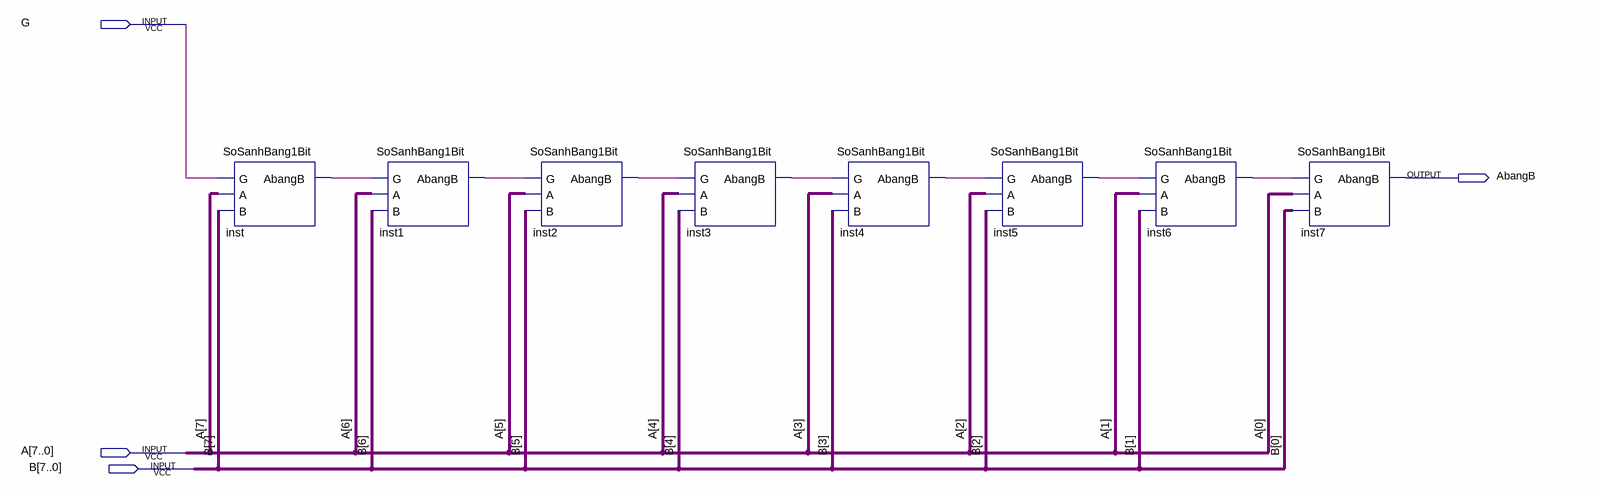
[diagram p0: schematic sheet]
// Quartus schematic SoSanh8bit.bdf as structural Verilog: 8 symbols, 4 pins
module SoSanh8bit (
  input  G,
  input  [7:0] A,
  input  [7:0] B,
  output AbangB
);

  wire inst1_abangb, inst2_abangb, inst3_abangb, inst4_abangb, inst5_abangb, inst6_abangb, inst_abangb;

  SoSanhBang1Bit inst (.G(G), .A(A[7]), .B(B[7]), .AbangB(inst_abangb));
  SoSanhBang1Bit inst1 (.G(inst_abangb), .A(A[6]), .B(B[6]), .AbangB(inst1_abangb));
  SoSanhBang1Bit inst2 (.G(inst1_abangb), .A(A[5]), .B(B[5]), .AbangB(inst2_abangb));
  SoSanhBang1Bit inst3 (.G(inst2_abangb), .A(A[4]), .B(B[4]), .AbangB(inst3_abangb));
  SoSanhBang1Bit inst4 (.G(inst3_abangb), .A(A[3]), .B(B[3]), .AbangB(inst4_abangb));
  SoSanhBang1Bit inst5 (.G(inst4_abangb), .A(A[2]), .B(B[2]), .AbangB(inst5_abangb));
  SoSanhBang1Bit inst6 (.G(inst5_abangb), .A(A[1]), .B(B[1]), .AbangB(inst6_abangb));
  SoSanhBang1Bit inst7 (.G(inst6_abangb), .A(A[0]), .B(B[0]), .AbangB(AbangB));
endmodule
